# EAGLE design DesignPrototype_RevC (EAGLE 9.1.3)
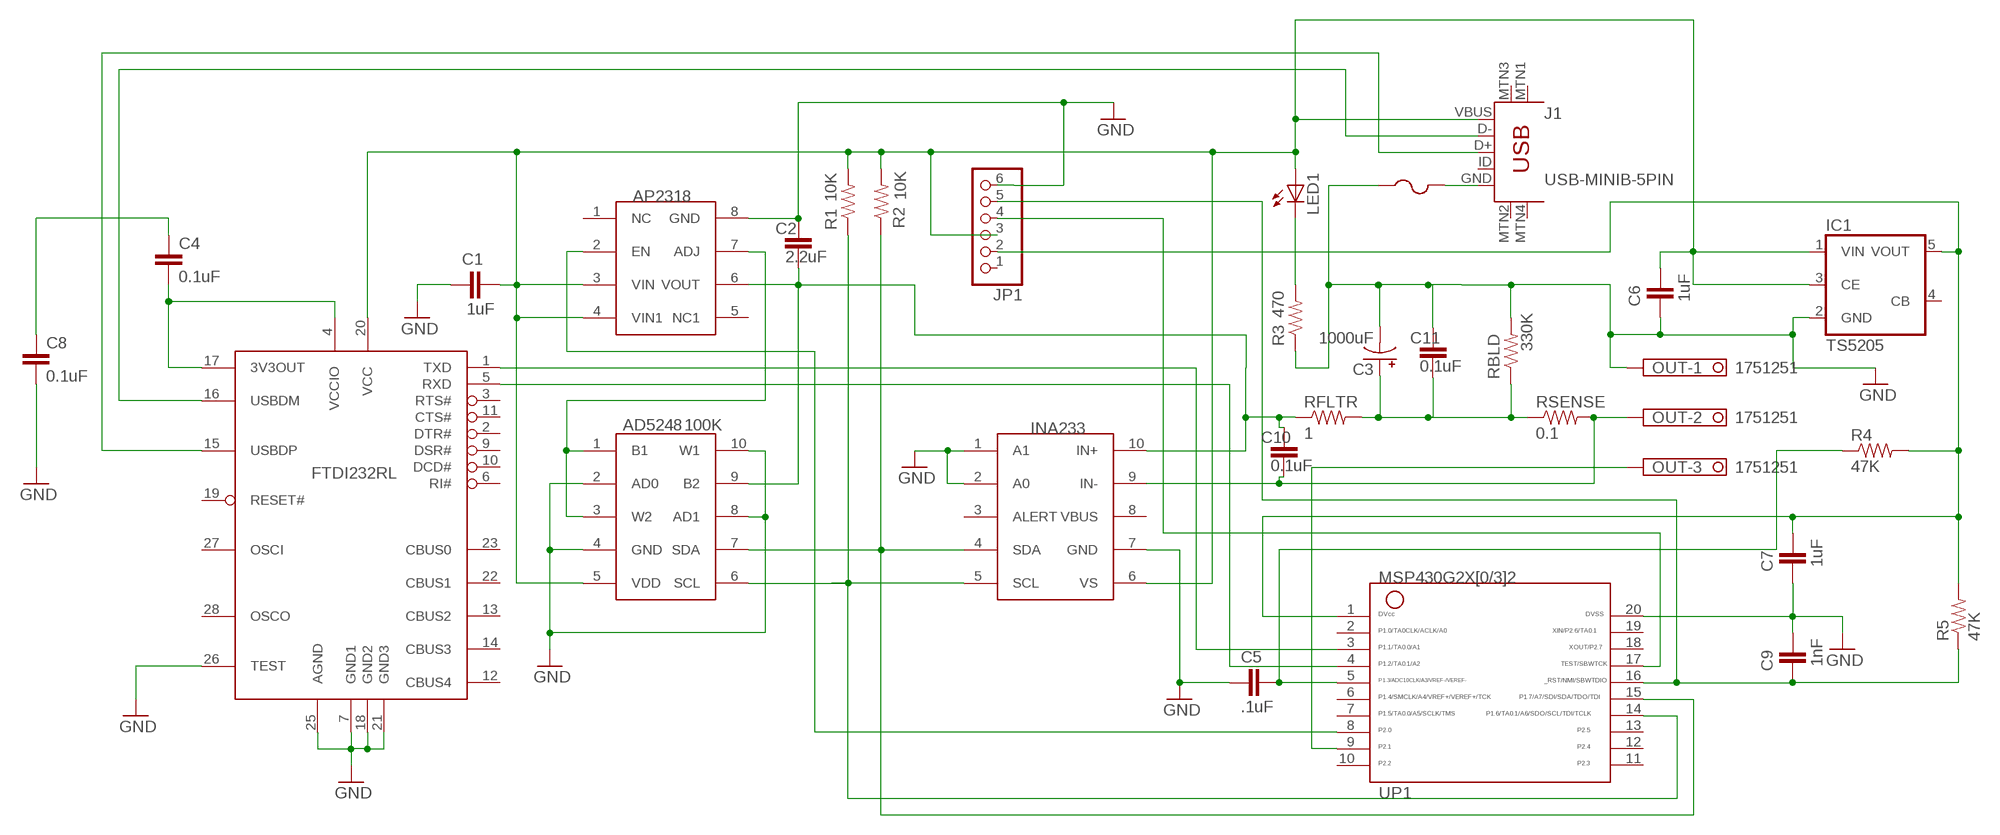
[diagram p0: schematic, sheet 1]

## Parts
AD5248  100K  AD5248  [MSOP-10]
AP2318  AP2318  [SOIC-8]
C1  1uF  CAP1206  [1206]
C2  2.2uF  CAP1206  [1206]
C3  1000uF  CPOL-USF  [PANASONIC_F]
C4  0.1uF  CAP1206  [1206]
C5  .1uF  CAP1206  [1206]
C6  1uF  CAP1206  [1206]
C7  1uF  CAP1206  [1206]
C8  0.1uF  CAP1206  [1206]
C9  1nF  CAP1206  [1206]
C10  0.1uF  CAP1206  [1206]
C11  0.1uF  CAP1206  [1206]
FTDI232RL  FT232RL  [SSOP28DB]
FUSE1  PTCFUSE-1206  [R1206]
IC1  TS5205  [SOT25]
INA233  INA233  [VSSOP-10]
J1  USB-MINIB-5PIN  [USB-MINIB]
JP1  PINHD-1X6  [1X06]
LED1  LEDCHIPLED_1206  [CHIPLED_1206]
OUT  1751251  [1751251]
R1  10K  RESISTOR1206  [1206]
R2  10K  RESISTOR1206  [1206]
R3  470  RESISTOR1206  [1206]
R4  47K  RESISTOR1206  [1206]
R5  47K  RESISTOR1206  [1206]
RBLD  330K  RESISTOR1206  [1206]
RFLTR  1  RESISTOR1206  [1206]
RSENSE  0.1  RESISTOR1206  [1206]
UP1  MSP430  G2X[0/3]2---PW20  [PW20]

## Nets
GND: AD5248.2(AD0) AD5248.4(GND) AD5248.8(AD1) AD5248.10(W1) AP2318.8(GND) C1.1 C2.1 C3.- C5.1 C6.1 C7.1 C8.2 C9.2 C11.1 FTDI232RL.7(GND1) FTDI232RL.18(GND2) FTDI232RL.21(GND3) FTDI232RL.25(AGND) FTDI232RL.26(TEST) FUSE1.1 IC1.2(GND) INA233.1(A1) INA233.2(A0) INA233.7(GND) JP1.6 OUT.1 R3.1 RBLD.2 UP1.20
N$1: AD5248.7(SDA) INA233.4(SDA) R2.1 UP1.15
N$2: FTDI232RL.5(RXD) UP1.4
N$3: FTDI232RL.1(TXD) UP1.3
N$4: AD5248.6(SCL) INA233.5(SCL) R1.1 UP1.14
N$5: FTDI232RL.16(USBDM) J1.D-
N$6: FTDI232RL.15(USBDP) J1.D+
N$7: AP2318.2(EN) UP1.8
N$8: FUSE1.2 J1.GND
N$9: C3.+ C11.2 RBLD.1 RFLTR.2 RSENSE.1
N$10: AD5248.1(B1) AD5248.3(W2) AP2318.7(ADJ)
N$11: C10.2 INA233.9(IN-) OUT.2 RSENSE.2
N$12: C4.2 FTDI232RL.4(VCCIO) FTDI232RL.17(3V3OUT)
N$13: JP1.4 UP1.17
N$14: LED1.C R3.2
N$15: C5.2 R4.1 UP1.5
N$16: AD5248.9(B2) AP2318.6(VOUT) C2.2 C10.1 INA233.10(IN+) RFLTR.1
N$19: C7.2 IC1.5(VOUT) JP1.2 R4.2 R5.2 UP1.1
N$20: C9.1 JP1.5 R5.1 UP1.16
N$21: OUT.3 UP1.9
N$23: C4.1 C8.1
N$25: AD5248.5(VDD) AP2318.3(VIN) AP2318.4(VIN1) C1.2 C6.2 FTDI232RL.20(VCC) IC1.1(VIN) IC1.3(CE) INA233.6(VS) J1.VBUS JP1.3 LED1.A R1.2 R2.2
Unconnected: AP2318.1(NC) AP2318.5(NC1) FTDI232RL.2(DTR#) FTDI232RL.3(RTS#) FTDI232RL.6(RI#) FTDI232RL.9(DSR#) FTDI232RL.10(DCD#) FTDI232RL.11(CTS#) FTDI232RL.12(CBUS4) FTDI232RL.13(CBUS2) FTDI232RL.14(CBUS3) FTDI232RL.19(RESET#) FTDI232RL.22(CBUS1) FTDI232RL.23(CBUS0) FTDI232RL.27(OSCI) FTDI232RL.28(OSCO) IC1.4(CB) INA233.3(ALERT) INA233.8(VBUS) J1.ID J1.MTN1(MTN2) J1.MTN2(MTN3) J1.MTN3(MTN1) J1.MTN4 JP1.1 UP1.2 UP1.6 UP1.7 UP1.10 UP1.11 UP1.12 UP1.13 UP1.18 UP1.19

## Library data of the parts
AD5248 = BluebirdLabs:AD5248
AP2318 = BluebirdLabs:AP2318
C1 C2 C4-C11 = SparkFun-Capacitors:CAP: Capacitor Standard 0603 ceramic capacitor, and 0.1" leaded capacitor.
C3 = adafruit:CPOL-US: POLARIZED CAPACITOR, American symbol
FTDI232RL = ftdichip-6:FT232RL: USB UART 4th Generation USB UART (USB <-> Serial) Controller
FUSE1 = adafruit:PTCFUSE: PTC fuses, resettable thermistors
IC1 = v-reg:TS5205: 150mA Low Noise LDO Voltage Regulator with Enable TSC [Taiwan Semiconductor Company, Ltd] Source: http://www.taiwansemi.com .. 5205_0409c.pdf
INA233 = BluebirdLabs:INA233: Texas Instruments current measurement
J1 = SparkFun-Connectors:USB-MINIB: Mini-USB "B" connector with 5th pin broken out. Created new symbol breaking out 5th "ID" pin in mini/micro USB connector spec. See: http://en.wikipedia.org/wiki/Mini_usb#Cables. Uses same footprint as 4-pin symbol. Also added pins to connect to mounting / shield pads if required (probably not generally needed as signals aren't shielded once they leave the connector).; PROD_ID: CONN-08193
JP1 = adafruit:PINHD-1X6: PIN HEADER
LED1 = led:LED: LED OSRAM: - CHIPLED LG R971, LG N971, LY N971, LG Q971, LY Q971, LO R971, LY R971 LH N974, LH R974 LS Q976, LO Q976, LY Q976 LO Q996 - Hyper CHIPLED LW Q18S LB Q993, LB Q99A, LB R99A - SideLED LS A670, LO A670, LY A670, LG A670, LP A670 LB A673, LV A673, LT A673, LW A673 LH A674 LY A675 LS A676, LA A676, LO A676, LY A676, LW A676 LS A679, LY A679, LG A679 - Hyper Micro SIDELED® LS Y876, LA Y876, LO Y876, LY Y876 LT Y87S - SmartLED LW L88C, LW L88S LB L89C, LB L89S, LG L890 LS L89K, LO L89K, LY L89K LS L896, LA L896, LO L896, LY L896 - TOPLED LS T670, LO T670, LY T670, LG T670, LP T670 LSG T670, LSP T670, LSY T670, LOP T670, LYG T670 LG T671, LOG T671, LSG T671 LB T673, LV T673, LT T673, LW T673 LH T674 LS T676, LA T676, LO T676, LY T676, LB T676, LH T676, LSB T676, LW T676 LB T67C, LV T67C, LT T67C, LS T67K, LO T67K, LY T67K, LW E67C LS E67B, LA E67B, LO E67B, LY E67B, LB E67C, LV E67C, LT E67C LW T67C LS T679, LY T679, LG T679 LS T770, LO T770, LY T770, LG T770, LP T770 LB T773, LV T773, LT T773, LW T773 LH T774 LS E675, LA E675, LY E675, LS T675 LS T776, LA T776, LO T776, LY T776, LB T776 LHGB T686 LT T68C, LB T68C - Hyper Mini TOPLED® LB M676 - Mini TOPLED Santana® LG M470 LS M47K, LO M47K, LY M47K Source: http://www.osram.convergy.de LUXEON: - LUMILED® LXK2-PW12-R00, LXK2-PW12-S00, LXK2-PW14-U00, LXK2-PW14-V00 LXK2-PM12-R00, LXK2-PM12-S00, LXK2-PM14-U00 LXK2-PE12-Q00, LXK2-PE12-R00, LXK2-PE12-S00, LXK2-PE14-T00, LXK2-PE14-U00 LXK2-PB12-K00, LXK2-PB12-L00, LXK2-PB12-M00, LXK2-PB14-N00, LXK2-PB14-P00, LXK2-PB14-Q00 LXK2-PR12-L00, LXK2-PR12-M00, LXK2-PR14-Q00, LXK2-PR14-R00 LXK2-PD12-Q00, LXK2-PD12-R00, LXK2-PD12-S00 LXK2-PH12-R00, LXK2-PH12-S00 LXK2-PL12-P00, LXK2-PL12-Q00, LXK2-PL12-R00 Source: www.luxeon.com KINGBRIGHT: KA-3528ASYC Source: www.kingbright.com
OUT = con-phoenix-350:1751251: MKDS 1/ 3-3,5 Printklemme Nennstrom: 10 A Bemessungsspannung: 160 V Raster: 3,5 mm Polzahl: 3 Montageart: Löten Anschlussart: Schraubanschluss Anschlussrichtung vom Leiter zur Platine: 0° Source: http://eshop.phoenixcontact.com .. 1751251.pdf; OC_FARNELL: unknown; OC_NEWARK: unknown
R1-R5 RBLD = SparkFun-Passives:RESISTOR: Resistor Basic schematic elements and footprints for 0603, 1206, and PTH resistors.
RFLTR RSENSE = SparkFun-Resistors:RESISTOR: Resistor Basic schematic elements and footprints for 0603, 1206, and PTH resistors.
UP1 = TI_MSP430_v16:G2X[0/3]2---PW20: MSP430G2X[0/3]2 MSP430G2x32, MSP430G2x02 TSSOP (PW) 20 Pin Package http://focus.ti.com/docs/prod/folders/print/msp430g2432.html

## Board
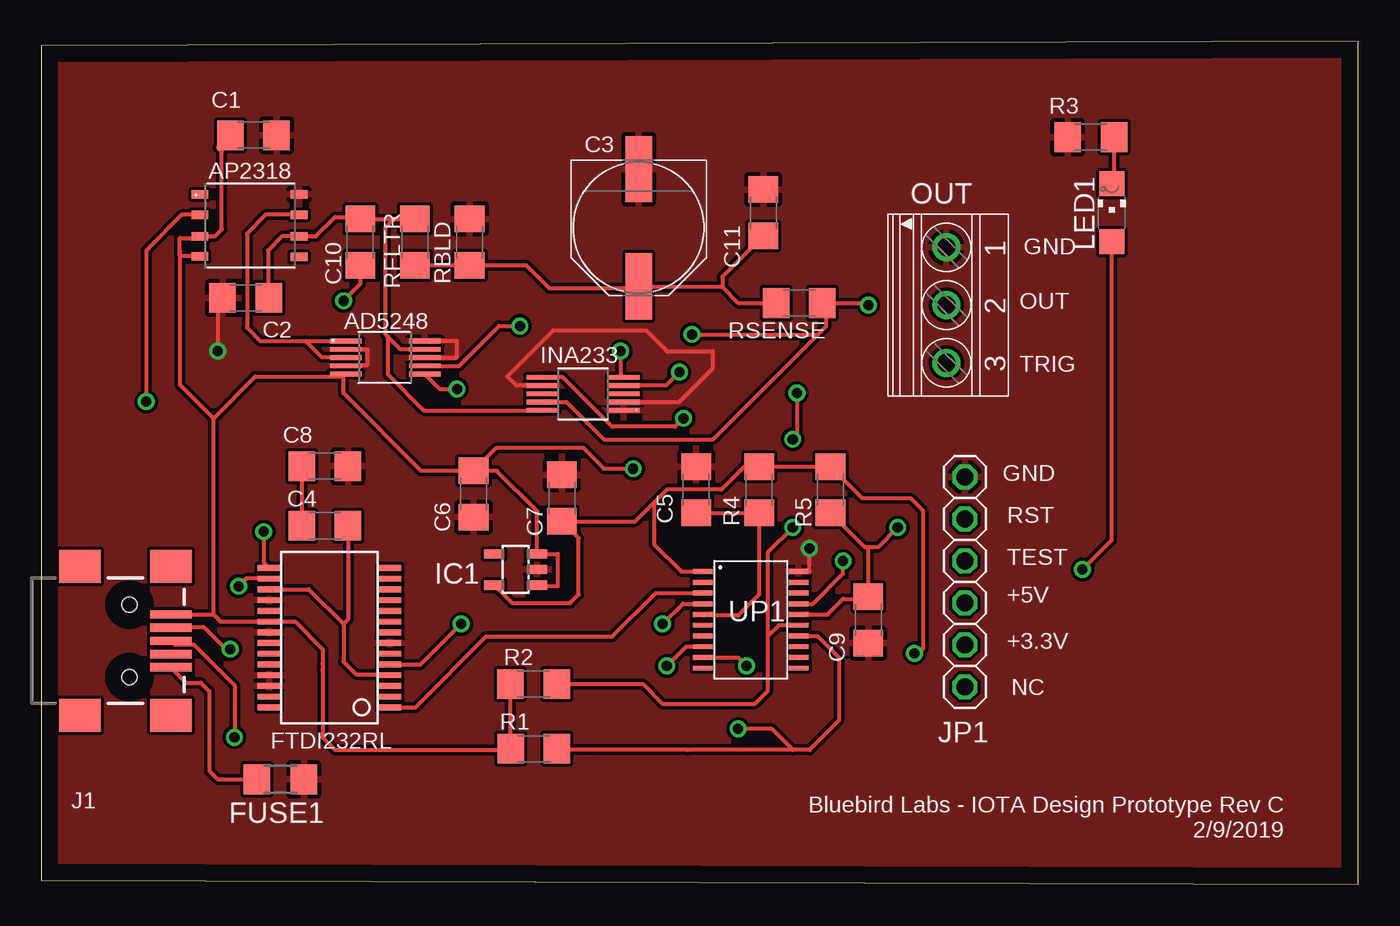
[diagram p1: board, top side]
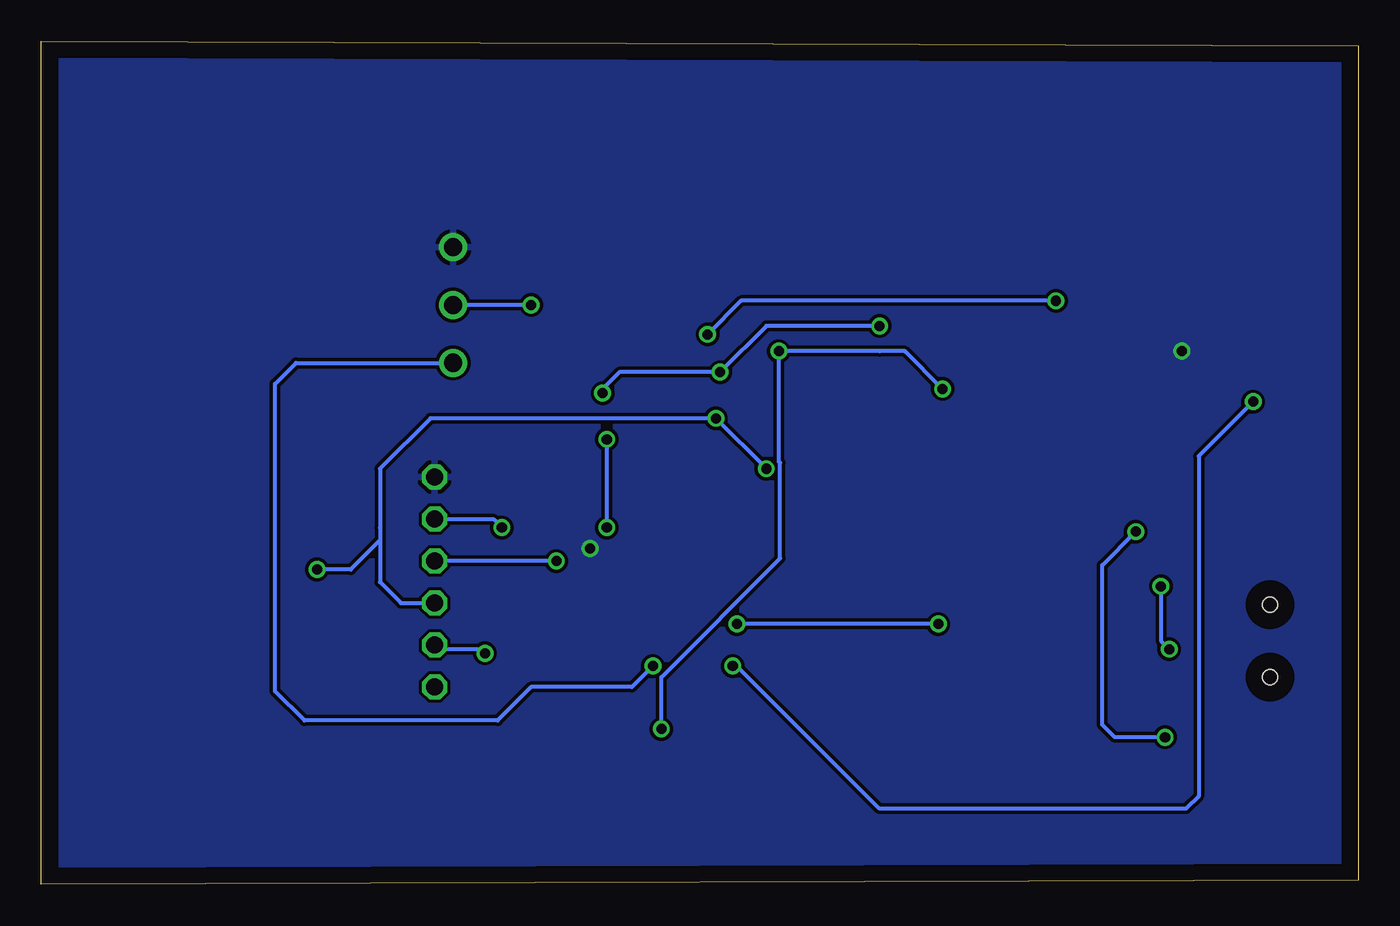
[diagram p2: board, bottom side, seen from below]

Size 79.68 x 51.01 mm. Coordinates in mm from the lower left corner, seen from the top.
Outline: 0,0.25 79.68,0 79.68,51.01 0,50.76 0,0.25
Copper layers (1*16): Top 0.035mm / dielectric 1.5mm / Bottom 0.035mm
Design rules "default": minimum track width 10mil, minimum drill 24mil, track to track 8mil, track to pad 8mil, pad to pad 8mil, via to via 8mil, smd to smd 8mil, copper to edge 40mil, drill to drill 8mil, minimum pad ring 10mil, minimum via ring 8mil, stop-mask expansion 4mil, vias tented up to drill 0mil, thermal gap 10mil

### Footprints (pad centres in the part's own frame; a part is rotated, then mirrored left to right if it is on the bottom)
MSOP-10 = smd 0.29 x 1.905: 1 -1,-2.327; 2 -0.5,-2.327; 3 0,-2.327; 4 0.5,-2.327; 5 1,-2.327; 6 1,2.454; 7 0.5,2.454; 8 0,2.454; 9 -0.5,2.454; 10 -1,2.454
SOIC-8 = smd 0.51 x 1: 1 -1.9,-3; 2 -0.65,-3; 3 0.65,-3; 4 1.85,-3; 5 1.9,3; 6 0.65,3; 7 -0.65,3; 8 -1.9,3
1206 = smd 1.6 x 1.8: 1 -1.4,0; 2 1.4,0
PANASONIC_F = smd 4 x 1.6: + 3.55,0; - -3.55,0
SSOP28DB = smd 0.348 x 1.397: 1 -4.225,-3.656; 2 -3.575,-3.656; 3 -2.925,-3.656; 4 -2.275,-3.656; 5 -1.625,-3.656; 6 -0.975,-3.656; 7 -0.325,-3.656; 8 0.325,-3.656; 9 0.975,-3.656; 10 1.625,-3.656; 11 2.275,-3.656; 12 2.925,-3.656; 13 3.575,-3.656; 14 4.225,-3.656; 15 4.225,3.656; 16 3.575,3.656; 17 2.925,3.656; 18 2.275,3.656; 19 1.625,3.656; 20 0.975,3.656; 21 0.325,3.656; 22 -0.325,3.656; 23 -0.975,3.656; 24 -1.625,3.656; 25 -2.275,3.656; 26 -2.925,3.656; 27 -3.575,3.656; 28 -4.225,3.656
R1206 = smd 1.6 x 1.803: 1 -1.422,0; 2 1.422,0
SOT25 = smd 0.55 x 1.2: 1 -0.95,-1.3; 2 0,-1.3; 3 0.95,-1.3; 4 0.95,1.3; 5 -0.95,1.3
VSSOP-10 = smd 0.29 x 1.905: 1 -1,-2.454; 2 -0.5,-2.454; 3 0,-2.454; 4 0.5,-2.454; 5 1,-2.454; 6 1,2.454; 7 0.5,2.454; 8 0,2.454; 9 -0.5,2.454; 10 -1,2.454
USB-MINIB = smd 2.5 x 0.5: D+ 2.5,0; D- 2.5,0.8; GND 2.5,-1.6; ID 2.5,-0.8; VBUS 2.5,1.6 | smd 2.5 x 2: MTN1 -3,4.5; MTN2 2.5,4.5; MTN3 -3,-4.5; MTN4 2.5,-4.5 | hole 0.9: 0,2.2; 0,-2.2
1X06 = drill 1.016 octagon: 1 -6.35,0; 2 -3.81,0; 3 -1.27,0; 4 1.27,0; 5 3.81,0; 6 6.35,0
CHIPLED_1206 = smd 1.5 x 1.5: A 0,-1.75; C 0,1.75
1751251 = drill 1.1 pad 1.7: 1 -3.5,-0.1; 2 0,-0.1; 3 3.5,-0.1
PW20 = smd 0.3 x 1.2: 1 -2.925,-2.9; 2 -2.275,-2.9; 3 -1.625,-2.9; 4 -0.975,-2.9; 5 -0.325,-2.9; 6 0.325,-2.9; 7 0.975,-2.9; 8 1.625,-2.9; 9 2.275,-2.9; 10 2.925,-2.9; 11 2.925,2.9; 12 2.275,2.9; 13 1.625,2.9; 14 0.975,2.9; 15 0.325,2.9; 16 -0.325,2.9; 17 -0.975,2.9; 18 -1.625,2.9; 19 -2.275,2.9; 20 -2.925,2.9

### Placement (x,y rotation side)
AD5248  20.74,31.87 270 top
AP2318  12.6,39.86 270 top
C1  12.84,45.32 180 top
C2  12.37,35.48 0 top
C3  36.14,39.73 270 top
C4  17.16,21.7 0 top
C5  39.62,23.88 270 top
C6  26.16,23.62 90 top
C7  31.5,23.37 270 top
C8  17.16,25.3 0 top
C9  50.04,16 270 top
C10  19.3,38.86 270 top
C11  43.69,40.64 270 top
FTDI232RL  17.43,14.92 90 top
FUSE1  14.48,6.35 180 top
IC1  28.7,19.05 90 top
INA233  32.78,29.68 90 top
J1  5.33,14.73 0 top
JP1  55.88,18.29 90 top
LED1  64.77,40.64 0 top
OUT  54.86,35.05 270 top
R1  29.8,8.2 180 top
R2  29.78,12.11 180 top
R3  63.5,45.21 0 top
R4  43.43,23.88 90 top
R5  47.75,23.88 90 top
RBLD  25.91,38.86 90 top
RFLTR  22.61,38.86 270 top
RSENSE  45.86,35.18 0 top
UP1  42.93,16 270 top

### Tracks (layer width: path | path; a pad name or v marks a point on that pad's centre or on a via)
GND  (via drill 0.61)
  Top 0.254: AD5248.8 25.15,31.87 25.15,32.87 AD5248.10 | 18.44,32.4 AD5248.2 19.7,32.37 19.7,31.4 19.05,31.4 19.05,31.37 AD5248.4 | C2.1 10.67,35.48 v10.67,32.26 | UP1.20 46.48,18.93 v46.48,20.32 | INA233.1 35.25,28.7 | 35.2,29.21 INA233.2 38.58,29.18 40.64,31.24 40.64,32.26 37.85,32.26 36.58,33.53 30.99,33.53 28.19,30.73 28.75,30.18 INA233.7
  pour Bottom: 0.24,50.35 78.78,50.67 78.78,0.49 0.24,0.49
  pour Top: 0.49,50.42 78.78,50.74 78.78,0.24 0.49,0.24
N$1  (via drill 0.61)
  Top 0.254: 34.84,30.18 INA233.4 37.8,30.18 v38.61,30.99 | AD5248.7 25.29,31.37 25.6,31.69 25.6,31.7 27.69,33.78 v28.96,33.78 | UP1.15 44.63,15.68 43.94,14.99 | 43.94,14.99 43.94,11.68 43.18,10.92 37.59,10.92 36.4,12.11 R2.1 | v45.72,29.72 45.72,27.18 v45.47,26.92 | v45.47,21.59 43.94,20.07 43.94,14.99
  Bottom 0.254: v28.96,33.78 35.81,33.78 v38.61,30.99 44.7,30.99 45.72,29.97 v45.72,29.72 | v45.47,26.92 v45.47,21.59
N$2  (via drill 0.61)
  Top 0.254: FTDI232RL.5 22.95,13.3 v25.4,15.75 | v37.59,15.75 38.82,16.98 UP1.4
  Bottom 0.254: v25.4,15.75 v37.59,15.75
N$3
  Top 0.254: FTDI232RL.1 22.64,10.7 26.92,14.99 34.54,14.99 37.19,17.63 UP1.3
N$4  (via drill 0.61)
  Top 0.254: AD5248.6 24.1,29.97 v25.15,29.97 | v35.05,32.26 35.05,30.68 INA233.5 | UP1.14 46.95,15.03 48.26,13.72 48.26,9.91 46.48,8.13 45.47,8.13 | 45.47,8.13 39.12,8.13 31.28,8.13 R1.1 | 45.47,8.13 44.2,9.4 v42.16,9.4
  Bottom 0.254: v25.15,29.97 27.43,32.26 28.96,32.26 v35.05,32.26 35.05,25.57 34.98,25.49 34.98,19.72 42.16,12.53 v42.16,9.4
N$5  (via drill 0.61)
  Top 0.254: FTDI232RL.16 12.4,18.5 v11.94,18.03 | v11.43,14.22 11.18,14.22 9.87,15.53 J1.D-
  Bottom 0.254: v11.94,18.03 11.94,14.73 v11.43,14.22
N$6  (via drill 0.61)
  Top 0.254: J1.D+ 8.05,14.51 9.22,14.51 11.68,12.05 v11.68,8.89 | v13.46,21.34 13.46,19.46 FTDI232RL.15
  Bottom 0.254: v11.68,8.89 14.73,8.89 15.49,9.65 15.49,19.3 v13.46,21.34
N$7  (via drill 0.61)
  Top 0.254: UP1.8 39.02,14.38 v37.85,13.21 | AP2318.2 8.5,40.51 6.35,38.35 v6.35,29.21
  Bottom 0.254: v6.35,29.21 9.65,25.91 9.65,5.33 10.41,4.57 13.46,4.57 | v37.85,13.21 37.85,13.46 28.96,4.57 13.46,4.57 | 12.95,4.57 13.46,4.57
N$8
  Top 0.254: J1.GND 8.77,12.19 9.65,12.19 10.16,11.68 10.16,6.86 10.67,6.35 FUSE1.2
N$9
  Top 0.254: RFLTR.2 RBLD.1 29.34,37.46 30.73,36.07 36.13,36.07 36.19,36.13 | RSENSE.1 42.16,35.18 41.21,36.13 | 43.44,39.49 C11.2 41.21,36.76 41.21,36.13 | 36.19,36.13 C3.+ | 41.21,36.13 36.19,36.13
N$10
  Top 0.254: AP2318.7 13.58,40.51 12.45,39.37 12.45,33.68 13.26,32.87 16,32.87 | 16,32.87 AD5248.1 | AD5248.3 17,31.87 16,32.87
N$11  (via drill 0.61)
  Top 0.254: RSENSE.2 47.5,35.18 | 47.5,35.18 50.04,35.18 v50.04,35.05 | 32.77,28.19 33.02,27.94 | 33.02,27.94 34.04,26.92 40.64,26.92 46.99,33.27 | 47.5,35.18 47.5,33.78 46.99,33.27 | C10.2 19.3,36.32 v18.29,35.31 | v39.37,33.27 46.99,33.27 | INA233.9 31.78,29.18 33.02,27.94
  Bottom 0.254: v50.04,35.05 OUT.2 | v18.29,35.31 37.34,35.31 v39.37,33.27
N$12
  Top 0.254: FTDI232RL.17 16.19,17.85 18.29,15.75 | 18.29,15.75 18.29,13.46 19.05,12.7 21.03,12.7 FTDI232RL.4 | C4.2 18.56,16.02 18.29,15.75
N$13  (via drill 0.61)
  Top 0.254: UP1.17 46.7,16.98 48.51,18.8 v48.51,19.56
  Bottom 0.254: 55.63,19.3 JP1.4 v48.51,19.56
N$14
  Top 0.254: R3.2 64.9,42.52 LED1.C
N$15
  Top 0.254: C5.2 R4.1 43.43,17.53 42.16,16.26 40.1,16.26 UP1.5
N$16
  Top 0.254: C2.2 13.72,35.53 13.72,38.35 14.57,39.21 AP2318.6 16.6,39.21 | 16.6,39.21 16.64,39.24 | 16.64,39.24 17.78,40.39 19.18,40.39 C10.1 21.34,40.26 | 21.34,40.26 RFLTR.1 | 21.34,40.26 20.83,39.75 20.83,33.27 20.95,33.15 | 21.73,32.37 21.72,32.38 | 21.72,32.38 20.95,33.15 | 20.95,33.15 20.95,30.86 23.13,28.68 INA233.10 | 16.6,39.21 16.64,39.24 | 21.72,32.38 23.19,32.38 AD5248.9
N$19  (via drill 0.61)
  Top 0.254: IC1.5 28.48,17.02 32,17.02 32.51,17.53 32.51,20.95 C7.2 35.94,21.97 37.08,23.11 | 37.08,23.11 37.85,23.88 41.15,23.88 42.55,25.28 R4.2 R5.2 49.66,23.37 52.58,23.37 53.34,22.61 53.34,14.22 53.09,14.22 v52.83,13.97 | UP1.1 38.73,18.93 37.08,20.57 37.08,23.11
  Bottom 0.254: v52.83,13.97 53.09,14.22 55.63,14.22 JP1.2
N$20  (via drill 0.61)
  Top 0.254: R5.1 49.85,20.38 | v51.82,21.59 50.61,20.38 49.85,20.38 | UP1.16 47.57,16.33 48.51,17.27 49.91,17.27 C9.1 50.04,20.38 49.85,20.38
  Bottom 0.254: JP1.5 52.32,22.1 v51.82,21.59
N$21  (via drill 0.61)
  Top 0.254: UP1.9 42.15,13.73 v42.67,13.21
  Bottom 0.254: v42.67,13.21 43.94,11.94 50.04,11.94 52.07,9.91 63.75,9.91 65.53,11.68 65.53,30.28 64.26,31.55 OUT.3
N$23
  Top 0.254: C8.1 C4.1
N$25  (via drill 0.61)
  Top 0.254: C1.2 10.69,44.58 10.92,44.35 10.92,39.62 10.51,39.21 9.65,39.21 | AP2318.3 9.65,39.21 | J1.VBUS 10.41,16.33 | 17.02,13.34 17.02,12.95 | 17.02,12.95 17.02,8.89 17.78,8.13 28.33,8.13 R1.2 28.4,12.09 R2.2 | LED1.A 64.77,20.83 v62.99,19.05 | C6.2 27.56,25.02 30,22.58 IC1.3 31.24,20 31.24,18.03 30,18.03 IC1.1 | C6.2 27.56,26.42 32.77,26.42 34.04,25.15 v35.81,25.15 | v38.86,28.19 38.35,27.69 34.54,27.69 31.55,30.68 INA233.6 | 10.41,28.19 12.95,30.73 18.28,30.73 18.28,30.74 | 18.28,30.74 AD5248.5 | 10.41,16.33 10.41,28.19 | AP2318.4 8.38,38.01 8.38,38.35 | 8.38,38.35 8.38,39.12 9.65,39.12 9.65,39.21 | 8.38,38.35 8.38,30.23 10.41,28.19 | C6.2 22.98,25.02 18.28,29.72 18.28,30.74 | 17.02,12.95 17.02,14.22 15.35,15.9 FTDI232RL.20 10.85,15.9 10.41,16.33
  Bottom 0.254: v35.81,25.15 v38.86,28.19 56.13,28.19 59.18,25.15 59.18,21.59 59.18,20.83 | JP1.3 57.91,17.02 59.18,18.29 59.18,20.83 | 59.18,20.83 60.96,19.05 v62.99,19.05

### Text on the board
tPlace: GND | OUT | TRIG | GND | RST | TEST | +5V | +3.3V | NC | Bluebird Labs - IOTA Design Prototype Rev C / 2/9/2019